# EAGLE schematic SPI_Test (EAGLE 9.6.2)
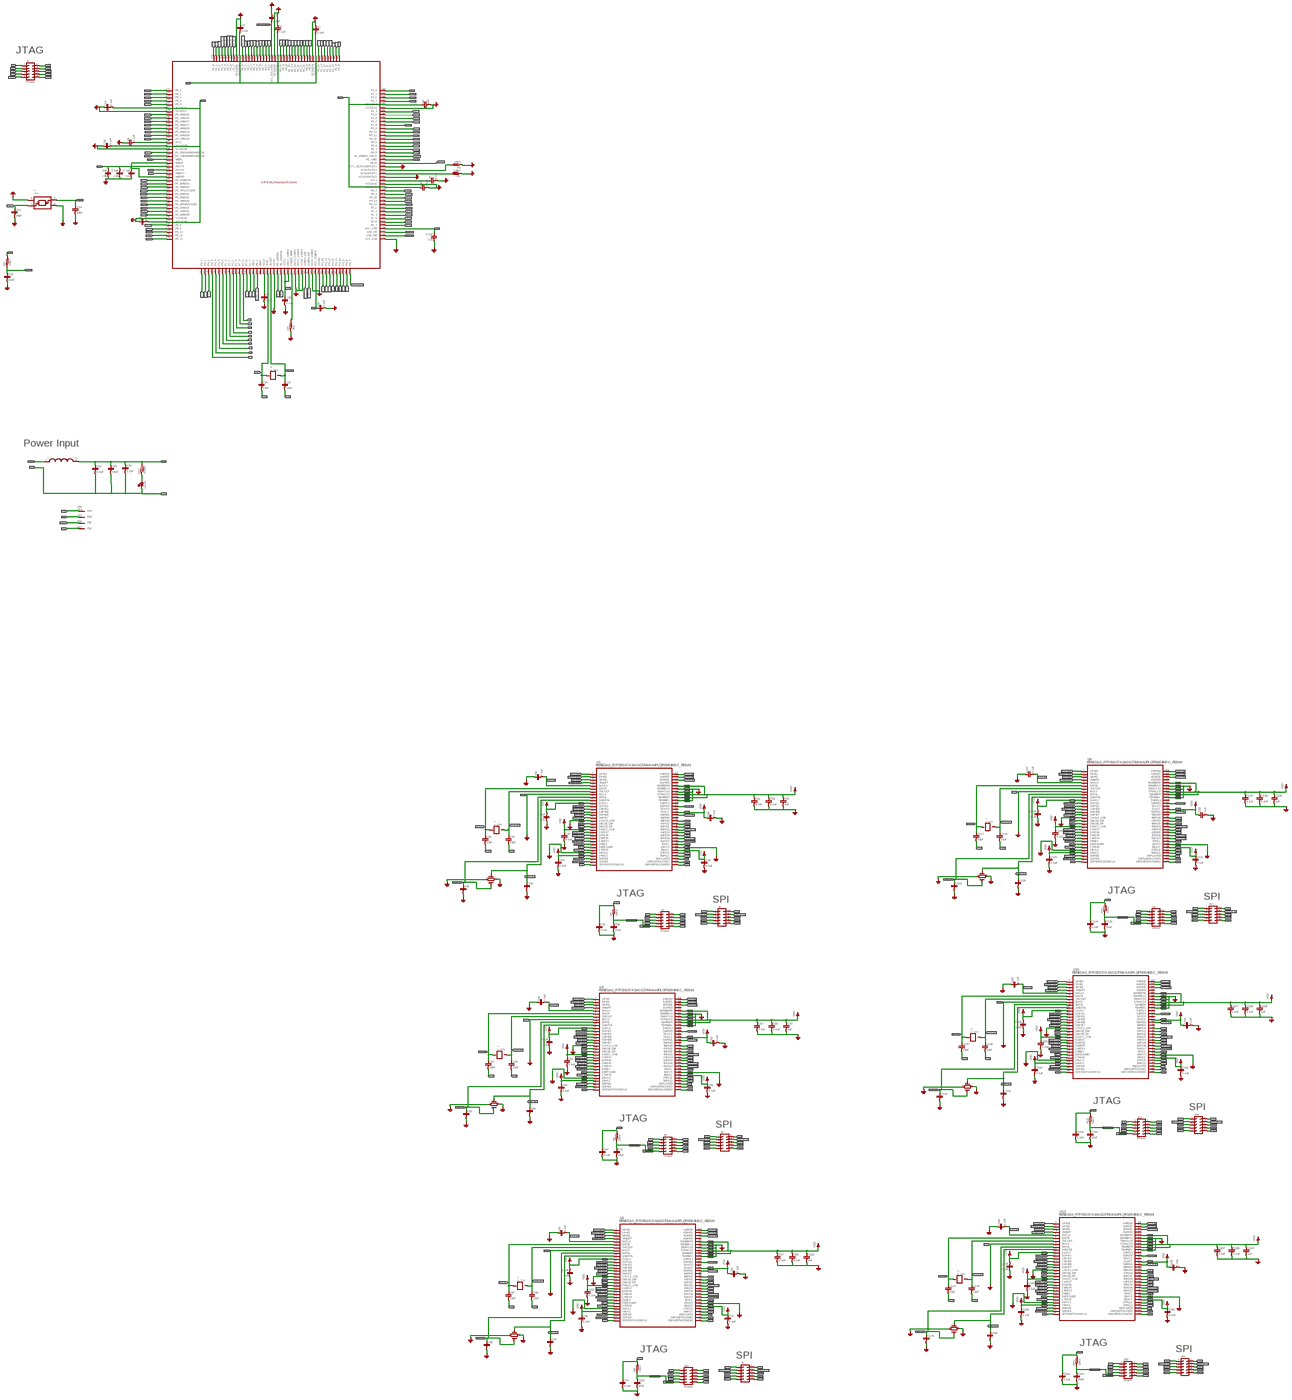
[diagram p0: schematic, sheet 1, overview]
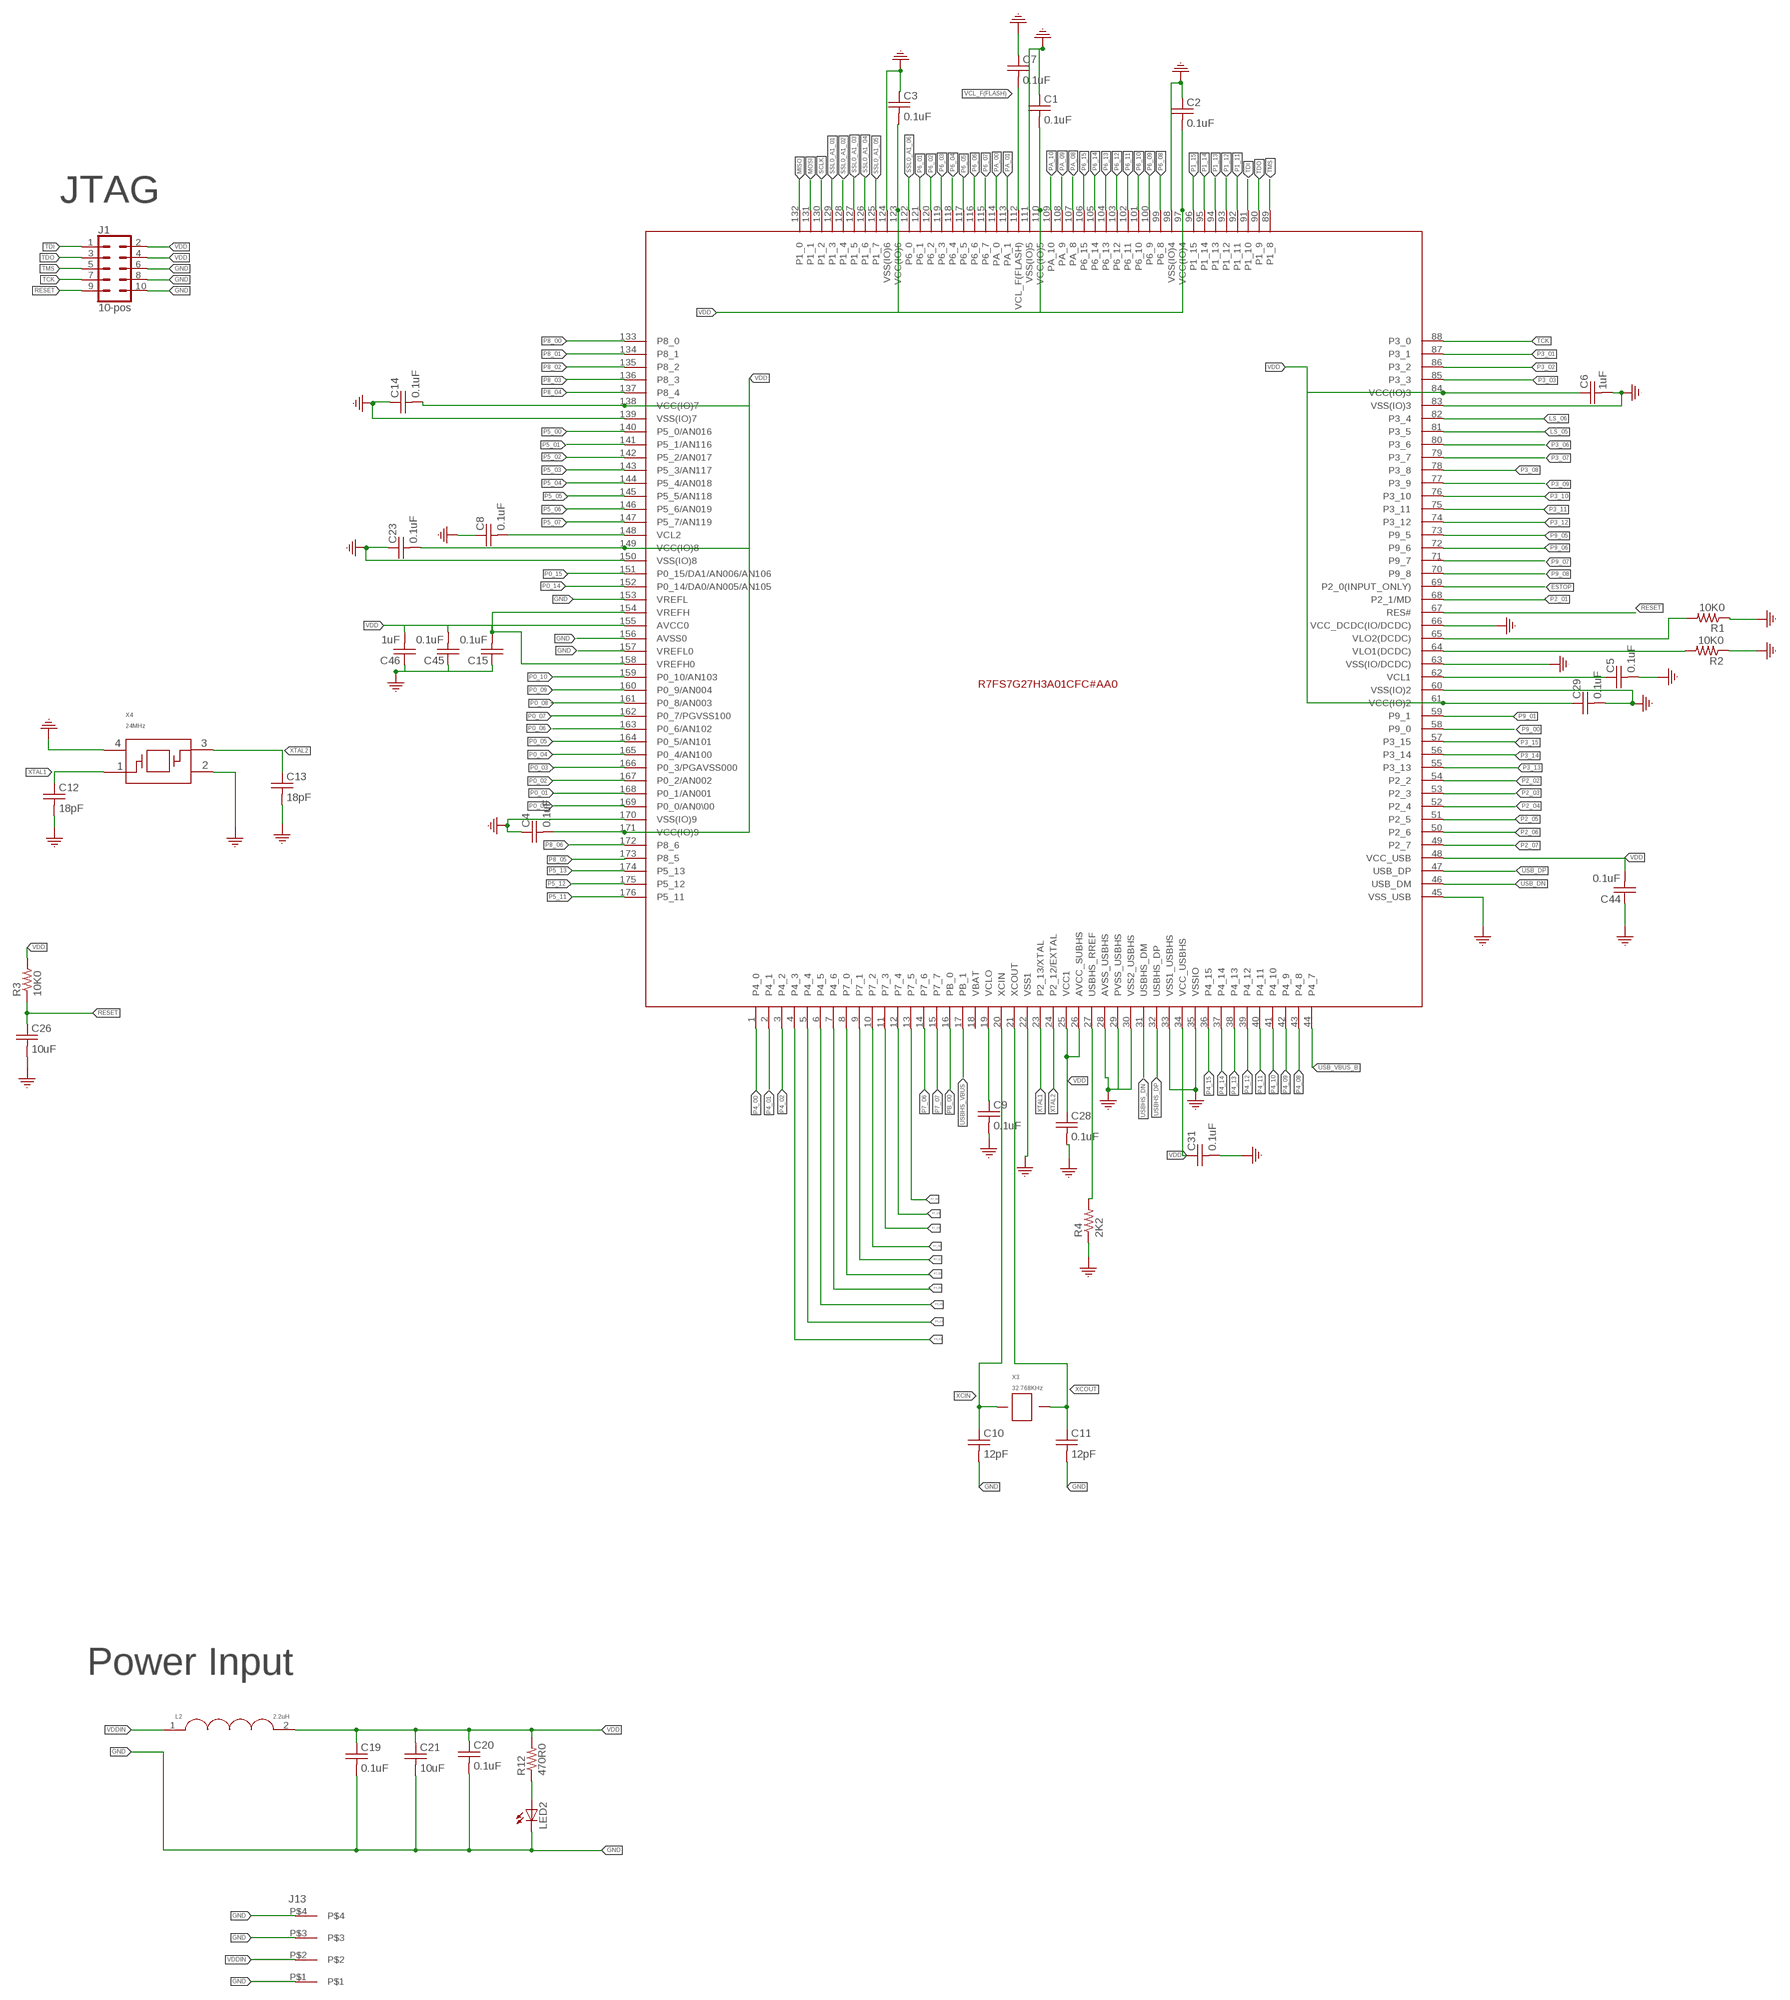
[diagram p1: schematic, sheet 1, part 1 of 5]
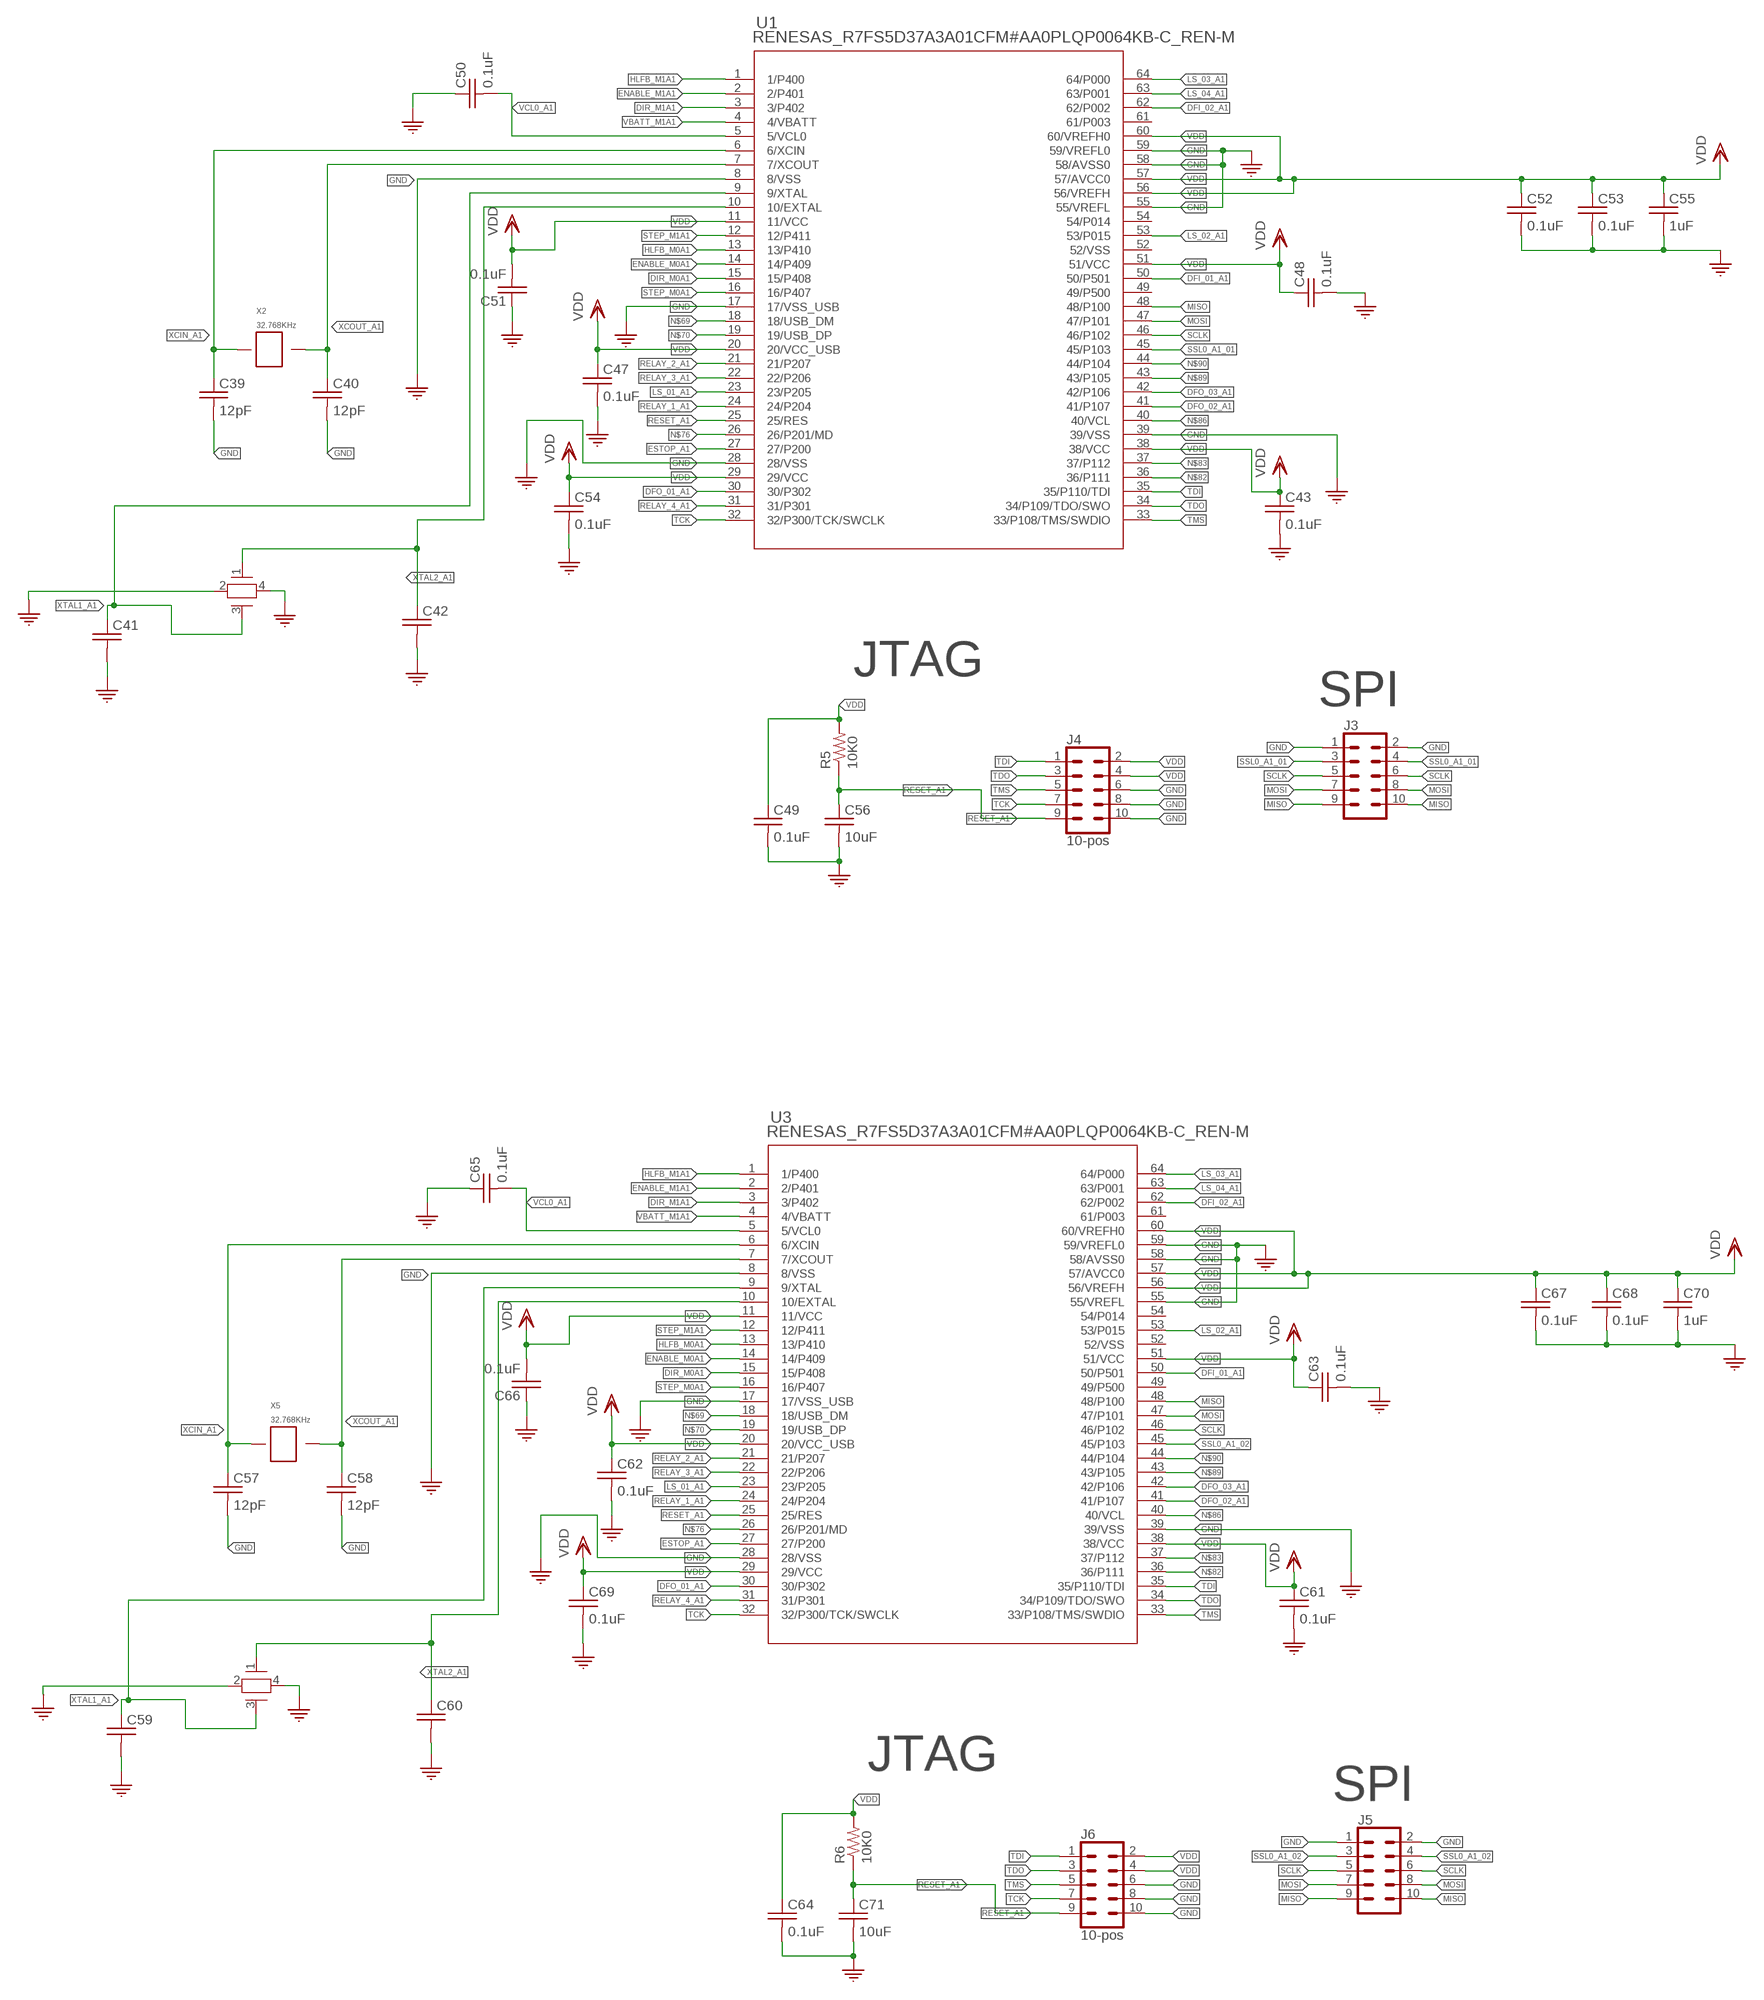
[diagram p2: schematic, sheet 1, part 2 of 5]
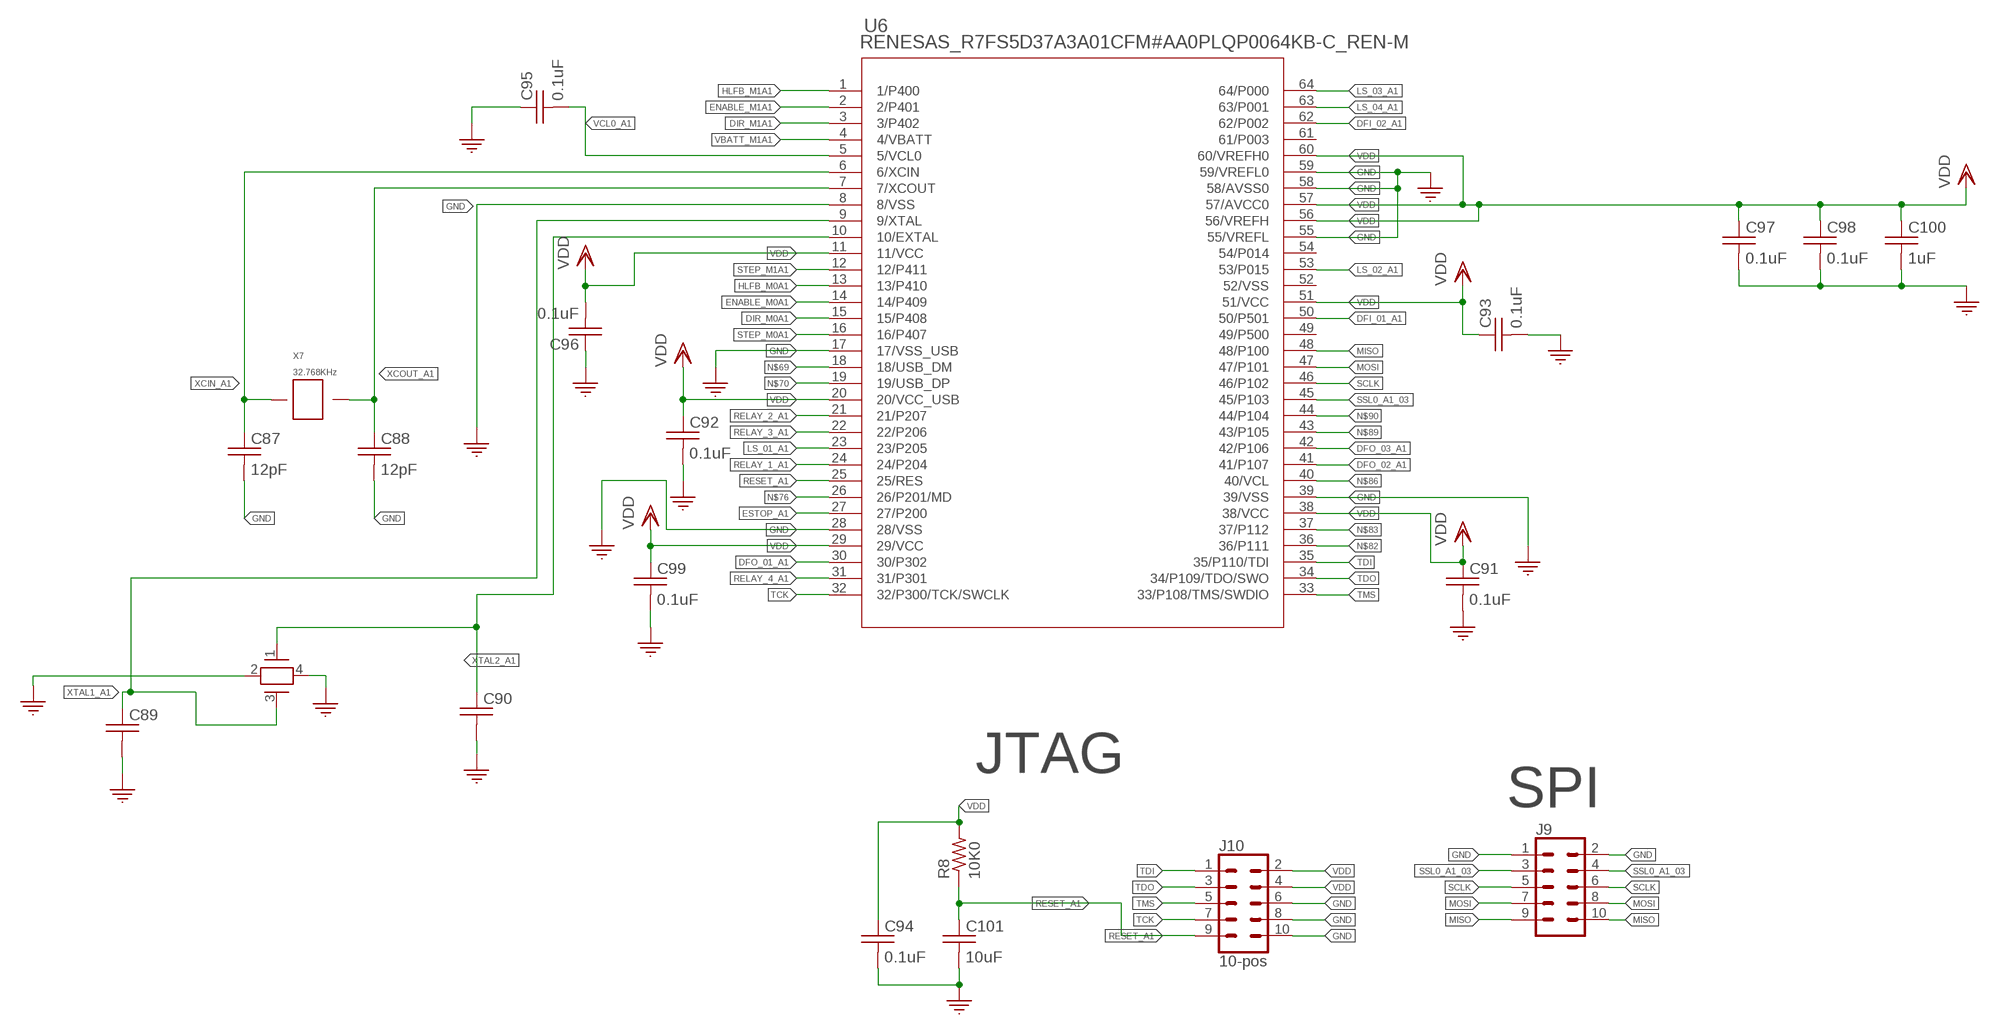
[diagram p3: schematic, sheet 1, part 3 of 5]
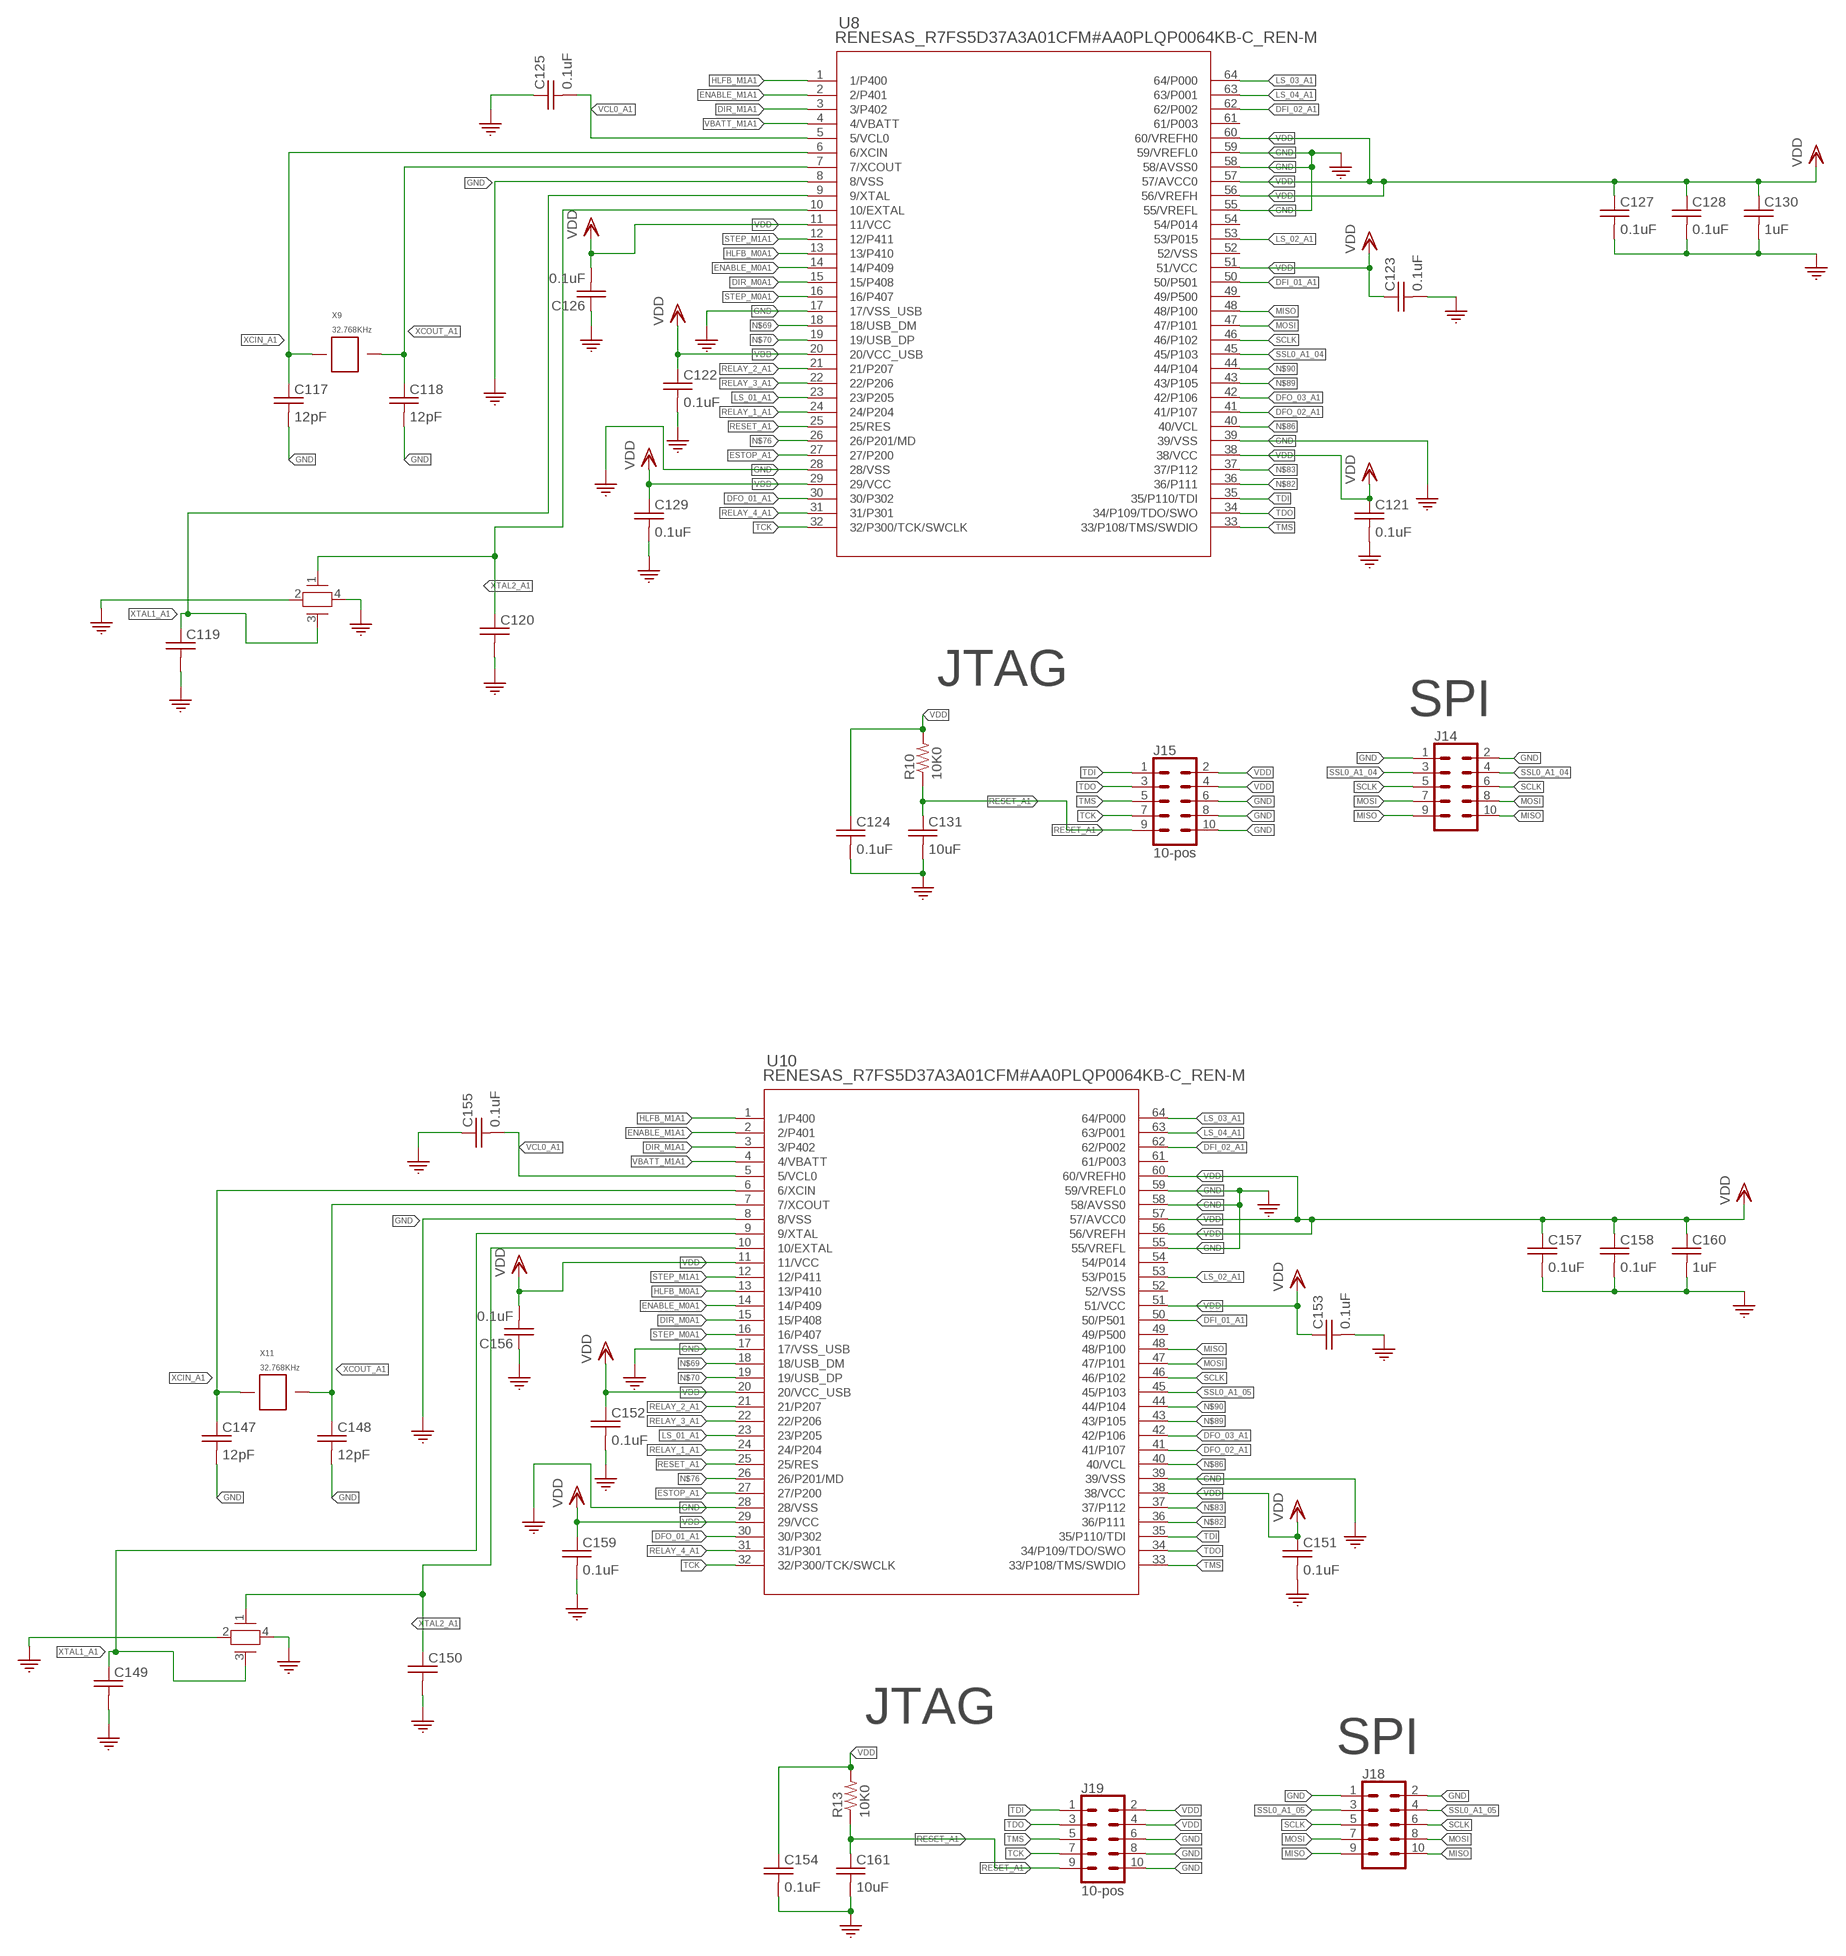
[diagram p4: schematic, sheet 1, part 4 of 5]
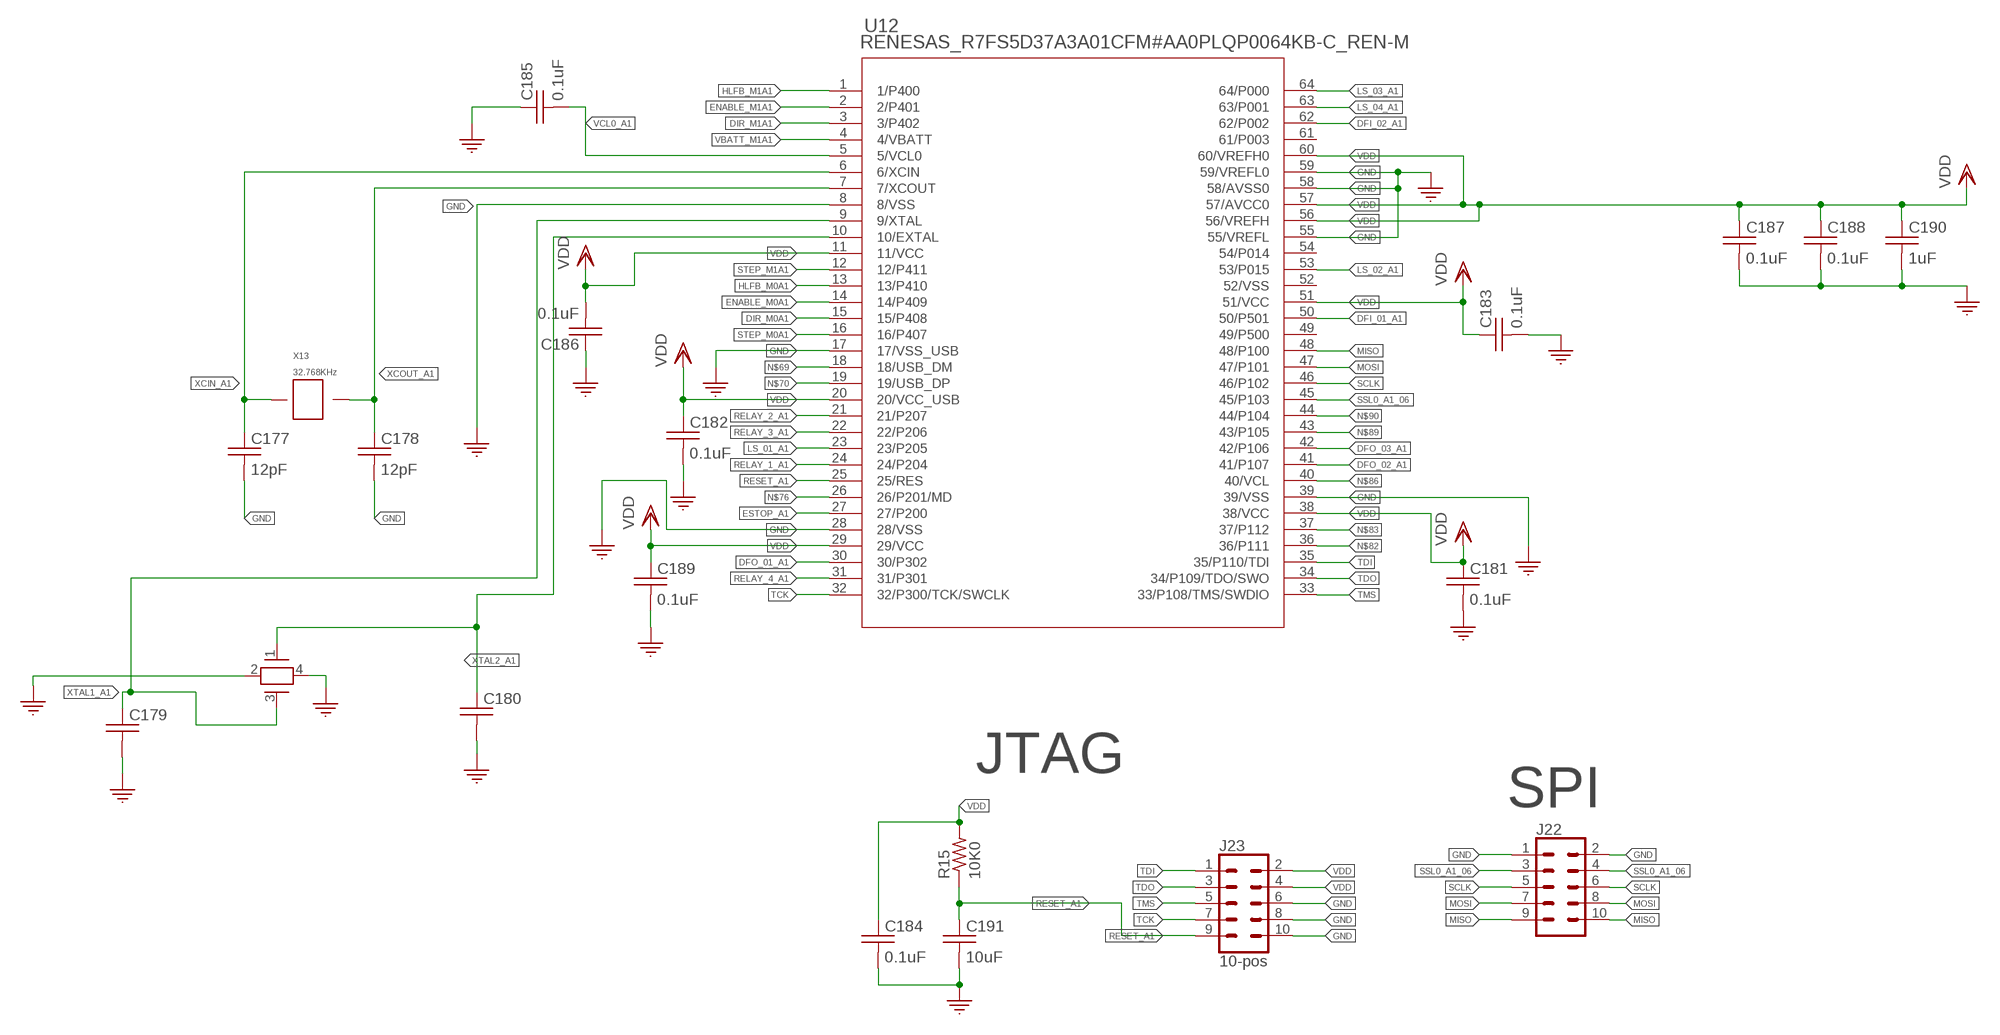
[diagram p5: schematic, sheet 1, part 5 of 5]

## Parts
C1  0.1uF  C_0402_0.1UF  [0402]
C2  0.1uF  C_0402_0.1UF  [0402]
C3  0.1uF  C_0402_0.1UF  [0402]
C4  0.1uF  C_0402_0.1UF  [0402]
C5  0.1uF  C_0402_0.1UF  [0402]
C6  1uF  C_0402_1UF  [0402]
C7  0.1uF  C_0402_0.1UF  [0402]
C8  0.1uF  C_0402_0.1UF  [0402]
C9  0.1uF  C_0402_0.1UF  [0402]
C10  12pF  C_0402_12PF  [0402]
C11  12pF  C_0402_12PF  [0402]
C12  18pF  C_0402_18PF  [0402]
C13  18pF  C_0402_18PF  [0402]
C14  0.1uF  C_0402_0.1UF  [0402]
C15  0.1uF  C_0402_0.1UF  [0402]
C19  0.1uF  C_0402_0.1UF  [0402]
C20  0.1uF  C_0402_0.1UF  [0402]
C21  10uF  C_0402_10UF  [0402]
C23  0.1uF  C_0402_0.1UF  [0402]
C26  10uF  C_0402_10UF  [0402]
C28  0.1uF  C_0402_0.1UF  [0402]
C29  0.1uF  C_0402_0.1UF  [0402]
C31  0.1uF  C_0402_0.1UF  [0402]
C39  12pF  C_0402_12PF  [0402]
C40  12pF  C_0402_12PF  [0402]
C41  10pF  C_0402_10PF  [0402]
C42  10pF  C_0402_10PF  [0402]
C43  0.1uF  C_0402_0.1UF  [0402]
C44  0.1uF  C_0402_0.1UF  [0402]
C45  0.1uF  C_0402_0.1UF  [0402]
C46  1uF  C_0402_1UF  [0402]
C47  0.1uF  C_0402_0.1UF  [0402]
C48  0.1uF  C_0402_0.1UF  [0402]
C49  0.1uF  C_0402_0.1UF  [0402]
C50  0.1uF  C_0402_0.1UF  [0402]
C51  0.1uF  C_0402_0.1UF  [0402]
C52  0.1uF  C_0402_0.1UF  [0402]
C53  0.1uF  C_0402_0.1UF  [0402]
C54  0.1uF  C_0402_0.1UF  [0402]
C55  1uF  C_0402_1UF  [0402]
C56  10uF  C_0402_10UF  [0402]
C57  12pF  C_0402_12PF  [0402]
C58  12pF  C_0402_12PF  [0402]
C59  10pF  C_0402_10PF  [0402]
C60  10pF  C_0402_10PF  [0402]
C61  0.1uF  C_0402_0.1UF  [0402]
C62  0.1uF  C_0402_0.1UF  [0402]
C63  0.1uF  C_0402_0.1UF  [0402]
C64  0.1uF  C_0402_0.1UF  [0402]
C65  0.1uF  C_0402_0.1UF  [0402]
C66  0.1uF  C_0402_0.1UF  [0402]
C67  0.1uF  C_0402_0.1UF  [0402]
C68  0.1uF  C_0402_0.1UF  [0402]
C69  0.1uF  C_0402_0.1UF  [0402]
C70  1uF  C_0402_1UF  [0402]
C71  10uF  C_0402_10UF  [0402]
C87  12pF  C_0402_12PF  [0402]
C88  12pF  C_0402_12PF  [0402]
C89  10pF  C_0402_10PF  [0402]
C90  10pF  C_0402_10PF  [0402]
C91  0.1uF  C_0402_0.1UF  [0402]
C92  0.1uF  C_0402_0.1UF  [0402]
C93  0.1uF  C_0402_0.1UF  [0402]
C94  0.1uF  C_0402_0.1UF  [0402]
C95  0.1uF  C_0402_0.1UF  [0402]
C96  0.1uF  C_0402_0.1UF  [0402]
C97  0.1uF  C_0402_0.1UF  [0402]
C98  0.1uF  C_0402_0.1UF  [0402]
C99  0.1uF  C_0402_0.1UF  [0402]
C100  1uF  C_0402_1UF  [0402]
C101  10uF  C_0402_10UF  [0402]
C117  12pF  C_0402_12PF  [0402]
C118  12pF  C_0402_12PF  [0402]
C119  10pF  C_0402_10PF  [0402]
C120  10pF  C_0402_10PF  [0402]
C121  0.1uF  C_0402_0.1UF  [0402]
C122  0.1uF  C_0402_0.1UF  [0402]
C123  0.1uF  C_0402_0.1UF  [0402]
C124  0.1uF  C_0402_0.1UF  [0402]
C125  0.1uF  C_0402_0.1UF  [0402]
C126  0.1uF  C_0402_0.1UF  [0402]
C127  0.1uF  C_0402_0.1UF  [0402]
C128  0.1uF  C_0402_0.1UF  [0402]
C129  0.1uF  C_0402_0.1UF  [0402]
C130  1uF  C_0402_1UF  [0402]
C131  10uF  C_0402_10UF  [0402]
C147  12pF  C_0402_12PF  [0402]
C148  12pF  C_0402_12PF  [0402]
C149  10pF  C_0402_10PF  [0402]
C150  10pF  C_0402_10PF  [0402]
C151  0.1uF  C_0402_0.1UF  [0402]
C152  0.1uF  C_0402_0.1UF  [0402]
C153  0.1uF  C_0402_0.1UF  [0402]
C154  0.1uF  C_0402_0.1UF  [0402]
C155  0.1uF  C_0402_0.1UF  [0402]
C156  0.1uF  C_0402_0.1UF  [0402]
C157  0.1uF  C_0402_0.1UF  [0402]
C158  0.1uF  C_0402_0.1UF  [0402]
C159  0.1uF  C_0402_0.1UF  [0402]
C160  1uF  C_0402_1UF  [0402]
C161  10uF  C_0402_10UF  [0402]
C177  12pF  C_0402_12PF  [0402]
C178  12pF  C_0402_12PF  [0402]
C179  10pF  C_0402_10PF  [0402]
C180  10pF  C_0402_10PF  [0402]
C181  0.1uF  C_0402_0.1UF  [0402]
C182  0.1uF  C_0402_0.1UF  [0402]
C183  0.1uF  C_0402_0.1UF  [0402]
C184  0.1uF  C_0402_0.1UF  [0402]
C185  0.1uF  C_0402_0.1UF  [0402]
C186  0.1uF  C_0402_0.1UF  [0402]
C187  0.1uF  C_0402_0.1UF  [0402]
C188  0.1uF  C_0402_0.1UF  [0402]
C189  0.1uF  C_0402_0.1UF  [0402]
C190  1uF  C_0402_1UF  [0402]
C191  10uF  C_0402_10UF  [0402]
J1  10-pos  CONN_05X2_RAPTH  [2X5]
J3  CONN_05X2PTH  [2X5]
J4  10-pos  CONN_05X2_RAPTH  [2X5]
J5  CONN_05X2PTH  [2X5]
J6  10-pos  CONN_05X2_RAPTH  [2X5]
J9  CONN_05X2PTH  [2X5]
J10  10-pos  CONN_05X2_RAPTH  [2X5]
J13  4-pos  3.81MM_1_X_4_RT_ANGLE_PLUG_HEADER  [1X4_3.81MM_PITCH]
J14  CONN_05X2PTH  [2X5]
J15  10-pos  CONN_05X2_RAPTH  [2X5]
J18  CONN_05X2PTH  [2X5]
J19  10-pos  CONN_05X2_RAPTH  [2X5]
J22  CONN_05X2PTH  [2X5]
J23  10-pos  CONN_05X2_RAPTH  [2X5]
L2  2.2uH  INDUCTOR_1008_2.2_MH_1.3A  [1008]
LED2  Green  LED_0805_GREEN  [0805]
R1  10K0  R_0402_10K0  [0402]
R2  10K0  R_0402_10K0  [0402]
R3  10K0  R_0402_10K0  [0402]
R4  2K2  R_0402_2K2  [0402]
R5  10K0  R_0402_10K0  [0402]
R6  10K0  R_0402_10K0  [0402]
R8  10K0  R_0402_10K0  [0402]
R10  10K0  R_0402_10K0  [0402]
R12  470R0  R_0402_470R0  [0402]
R13  10K0  R_0402_10K0  [0402]
R15  10K0  R_0402_10K0  [0402]
U1  RENESAS_R7FS5D37A3A01CFM#AA0PLQP0064KB-C_REN-M  [PLQP0064KB-C_REN-M]
U2  S7G2LQFP176  RENESAS_S7G2_X_176  [LQFP176_24X24]
U3  RENESAS_R7FS5D37A3A01CFM#AA0PLQP0064KB-C_REN-M  [PLQP0064KB-C_REN-M]
U6  RENESAS_R7FS5D37A3A01CFM#AA0PLQP0064KB-C_REN-M  [PLQP0064KB-C_REN-M]
U8  RENESAS_R7FS5D37A3A01CFM#AA0PLQP0064KB-C_REN-M  [PLQP0064KB-C_REN-M]
U10  RENESAS_R7FS5D37A3A01CFM#AA0PLQP0064KB-C_REN-M  [PLQP0064KB-C_REN-M]
U12  RENESAS_R7FS5D37A3A01CFM#AA0PLQP0064KB-C_REN-M  [PLQP0064KB-C_REN-M]
X2  32.768KHz  XTAL_32.768KHZ  [SMD_X_2_PADS]
X3  32.768KHz  XTAL_32.768KHZ  [SMD_X_2_PADS]
X4  24MHz  XTAL_24_MHZ  [SMD_3225]
X5  32.768KHz  XTAL_32.768KHZ  [SMD_X_2_PADS]
X7  32.768KHz  XTAL_32.768KHZ  [SMD_X_2_PADS]
X9  32.768KHz  XTAL_32.768KHZ  [SMD_X_2_PADS]
X11  32.768KHz  XTAL_32.768KHZ  [SMD_X_2_PADS]
X13  32.768KHz  XTAL_32.768KHZ  [SMD_X_2_PADS]
Y1  XTAL_12MHZ_ABM8G-12.000MHZ-B4Y-T  [CRYSTAL_ABM8G_ABR]
Y3  XTAL_12MHZ_ABM8G-12.000MHZ-B4Y-T  [CRYSTAL_ABM8G_ABR]
Y5  XTAL_12MHZ_ABM8G-12.000MHZ-B4Y-T  [CRYSTAL_ABM8G_ABR]
Y7  XTAL_12MHZ_ABM8G-12.000MHZ-B4Y-T  [CRYSTAL_ABM8G_ABR]
Y9  XTAL_12MHZ_ABM8G-12.000MHZ-B4Y-T  [CRYSTAL_ABM8G_ABR]
Y11  XTAL_12MHZ_ABM8G-12.000MHZ-B4Y-T  [CRYSTAL_ABM8G_ABR]

## Nets
DFI_01_A1: U1.50(50/P501) U3.50(50/P501) U6.50(50/P501) U8.50(50/P501) U10.50(50/P501) U12.50(50/P501)
DFI_02_A1: U1.62(62/P002) U3.62(62/P002) U6.62(62/P002) U8.62(62/P002) U10.62(62/P002) U12.62(62/P002)
DFO_01_A1: U1.30(30/P302) U3.30(30/P302) U6.30(30/P302) U8.30(30/P302) U10.30(30/P302) U12.30(30/P302)
DFO_02_A1: U1.41(41/P107) U3.41(41/P107) U6.41(41/P107) U8.41(41/P107) U10.41(41/P107) U12.41(41/P107)
DFO_03_A1: U1.42(42/P106) U3.42(42/P106) U6.42(42/P106) U8.42(42/P106) U10.42(42/P106) U12.42(42/P106)
DIR_M0A1: U1.15(15/P408) U3.15(15/P408) U6.15(15/P408) U8.15(15/P408) U10.15(15/P408) U12.15(15/P408)
DIR_M1A1: U1.3(3/P402) U3.3(3/P402) U6.3(3/P402) U8.3(3/P402) U10.3(3/P402) U12.3(3/P402)
ENABLE_M0A1: U1.14(14/P409) U3.14(14/P409) U6.14(14/P409) U8.14(14/P409) U10.14(14/P409) U12.14(14/P409)
ENABLE_M1A1: U1.2(2/P401) U3.2(2/P401) U6.2(2/P401) U8.2(2/P401) U10.2(2/P401) U12.2(2/P401)
ESTOP: U2.69(P2_0(INPUT_ONLY))
ESTOP_A1: U1.27(27/P200) U3.27(27/P200) U6.27(27/P200) U8.27(27/P200) U10.27(27/P200) U12.27(27/P200)
GND: C1.P$1 C2.P$1 C3.P$1 C4.P$1 C5.P$2 C6.P$2 C7.P$1 C8.P$1 C9.P$2 C10.P$2 C11.P$2 C12.P$2 C13.P$2 C14.P$1 C15.P$1 C19.P$2 C20.P$2 C21.P$2 C23.P$1 C26.P$2 C28.P$2 C29.P$2 C31.P$2 C39.P$2 C40.P$2 C41.P$2 C42.P$2 C43.P$2 C44.P$1 C45.P$1 C46.P$1 C47.P$2 C48.P$2 C49.P$2 C50.P$1 C51.P$1 C52.P$2 C53.P$2 C54.P$2 C55.P$2 C56.P$2 C57.P$2 C58.P$2 C59.P$2 C60.P$2 C61.P$2 C62.P$2 C63.P$2 C64.P$2 C65.P$1 C66.P$1 C67.P$2 C68.P$2 C69.P$2 C70.P$2 C71.P$2 C87.P$2 C88.P$2 C89.P$2 C90.P$2 C91.P$2 C92.P$2 C93.P$2 C94.P$2 C95.P$1 C96.P$1 C97.P$2 C98.P$2 C99.P$2 C100.P$2 C101.P$2 C117.P$2 C118.P$2 C119.P$2 C120.P$2 C121.P$2 C122.P$2 C123.P$2 C124.P$2 C125.P$1 C126.P$1 C127.P$2 C128.P$2 C129.P$2 C130.P$2 C131.P$2 C147.P$2 C148.P$2 C149.P$2 C150.P$2 C151.P$2 C152.P$2 C153.P$2 C154.P$2 C155.P$1 C156.P$1 C157.P$2 C158.P$2 C159.P$2 C160.P$2 C161.P$2 C177.P$2 C178.P$2 C179.P$2 C180.P$2 C181.P$2 C182.P$2 C183.P$2 C184.P$2 C185.P$1 C186.P$1 C187.P$2 C188.P$2 C189.P$2 C190.P$2 C191.P$2 J1.6 J1.8 J1.10 J3.1 J3.2 J4.6 J4.8 J4.10 J5.1 J5.2 J6.6 J6.8 J6.10 J9.1 J9.2 J10.6 J10.8 J10.10 J13.P$1 J13.P$3 J13.P$4 J14.1 J14.2 J15.6 J15.8 J15.10 J18.1 J18.2 J19.6 J19.8 J19.10 J22.1 J22.2 J23.6 J23.8 J23.10 LED2.2(C) R1.P$1 R2.P$1 R4.P$1 U1.8(8/VSS) U1.17(17/VSS_USB) U1.28(28/VSS) U1.39(39/VSS) U1.55(55/VREFL) U1.58(58/AVSS0) U1.59(59/VREFL0) U2.22(VSS1) U2.28(AVSS_USBHS) U2.29(PVSS_USBHS) U2.30(VSS2_USBHS) U2.33(VSS1_USBHS) U2.35(VSSIO) U2.45(VSS_USB) U2.60(VSS(IO)2) U2.63(VSS(IO/DCDC)) U2.66(VCC_DCDC(IO/DCDC)) U2.83(VSS(IO)3) U2.98(VSS(IO)4) U2.111(VSS(IO)5) U2.124(VSS(IO)6) U2.139(VSS(IO)7) U2.150(VSS(IO)8) U2.153(VREFL) U2.156(AVSS0) U2.157(VREFL0) U2.170(VSS(IO)9) U3.8(8/VSS) U3.17(17/VSS_USB) U3.28(28/VSS) U3.39(39/VSS) U3.55(55/VREFL) U3.58(58/AVSS0) U3.59(59/VREFL0) U6.8(8/VSS) U6.17(17/VSS_USB) U6.28(28/VSS) U6.39(39/VSS) U6.55(55/VREFL) U6.58(58/AVSS0) U6.59(59/VREFL0) U8.8(8/VSS) U8.17(17/VSS_USB) U8.28(28/VSS) U8.39(39/VSS) U8.55(55/VREFL) U8.58(58/AVSS0) U8.59(59/VREFL0) U10.8(8/VSS) U10.17(17/VSS_USB) U10.28(28/VSS) U10.39(39/VSS) U10.55(55/VREFL) U10.58(58/AVSS0) U10.59(59/VREFL0) U12.8(8/VSS) U12.17(17/VSS_USB) U12.28(28/VSS) U12.39(39/VSS) U12.55(55/VREFL) U12.58(58/AVSS0) U12.59(59/VREFL0) X4.2 X4.4 Y1.2 Y1.4 Y3.2 Y3.4 Y5.2 Y5.4 Y7.2 Y7.4 Y9.2 Y9.4 Y11.2 Y11.4
HLFB_M0A1: U1.13(13/P410) U3.13(13/P410) U6.13(13/P410) U8.13(13/P410) U10.13(13/P410) U12.13(13/P410)
HLFB_M1A1: U1.1(1/P400) U3.1(1/P400) U6.1(1/P400) U8.1(1/P400) U10.1(1/P400) U12.1(1/P400)
LS_01_A1: U1.23(23/P205) U3.23(23/P205) U6.23(23/P205) U8.23(23/P205) U10.23(23/P205) U12.23(23/P205)
LS_02_A1: U1.53(53/P015) U3.53(53/P015) U6.53(53/P015) U8.53(53/P015) U10.53(53/P015) U12.53(53/P015)
LS_03_A1: U1.64(64/P000) U3.64(64/P000) U6.64(64/P000) U8.64(64/P000) U10.64(64/P000) U12.64(64/P000)
LS_04_A1: U1.63(63/P001) U3.63(63/P001) U6.63(63/P001) U8.63(63/P001) U10.63(63/P001) U12.63(63/P001)
LS_05: U2.81(P3_5)
LS_06: U2.82(P3_4)
MISO: J3.9 J3.10 J5.9 J5.10 J9.9 J9.10 J14.9 J14.10 J18.9 J18.10 J22.9 J22.10 U1.48(48/P100) U2.132(P1_0) U3.48(48/P100) U6.48(48/P100) U8.48(48/P100) U10.48(48/P100) U12.48(48/P100)
MOSI: J3.7 J3.8 J5.7 J5.8 J9.7 J9.8 J14.7 J14.8 J18.7 J18.8 J22.7 J22.8 U1.47(47/P101) U2.131(P1_1) U3.47(47/P101) U6.47(47/P101) U8.47(47/P101) U10.47(47/P101) U12.47(47/P101)
N$2: C8.P$2 U2.148(VCL2)
N$3: C9.P$1 U2.19(VCLO)
N$4: LED2.1(A) R12.P$1
N$9: C5.P$1 U2.62(VCL1)
N$10: R2.P$2 U2.64(VLO1(DCDC))
N$11: R1.P$2 U2.65(VLO2(DCDC))
N$12: R4.P$2 U2.27(USBHS_RREF)
N$69: U1.18(18/USB_DM) U3.18(18/USB_DM) U6.18(18/USB_DM) U8.18(18/USB_DM) U10.18(18/USB_DM) U12.18(18/USB_DM)
N$70: U1.19(19/USB_DP) U3.19(19/USB_DP) U6.19(19/USB_DP) U8.19(19/USB_DP) U10.19(19/USB_DP) U12.19(19/USB_DP)
N$76: U1.26(26/P201/MD) U3.26(26/P201/MD) U6.26(26/P201/MD) U8.26(26/P201/MD) U10.26(26/P201/MD) U12.26(26/P201/MD)
N$82: U1.36(36/P111) U3.36(36/P111) U6.36(36/P111) U8.36(36/P111) U10.36(36/P111) U12.36(36/P111)
N$83: U1.37(37/P112) U3.37(37/P112) U6.37(37/P112) U8.37(37/P112) U10.37(37/P112) U12.37(37/P112)
N$86: U1.40(40/VCL) U3.40(40/VCL) U6.40(40/VCL) U8.40(40/VCL) U10.40(40/VCL) U12.40(40/VCL)
N$89: U1.43(43/P105) U3.43(43/P105) U6.43(43/P105) U8.43(43/P105) U10.43(43/P105) U12.43(43/P105)
N$90: U1.44(44/P104) U3.44(44/P104) U6.44(44/P104) U8.44(44/P104) U10.44(44/P104) U12.44(44/P104)
P0_00: U2.169(P0_0/AN0\00)
P0_01: U2.168(P0_1/AN001)
P0_02: U2.167(P0_2/AN002)
P0_03: U2.166(P0_3/PGAVSS000)
P0_04: U2.165(P0_4/AN100)
P0_05: U2.164(P0_5/AN101)
P0_06: U2.163(P0_6/AN102)
P0_07: U2.162(P0_7/PGVSS100)
P0_08: U2.161(P0_8/AN003)
P0_09: U2.160(P0_9/AN004)
P0_10: U2.159(P0_10/AN103)
P0_14: U2.152(P0_14/DA0/AN005/AN105)
P0_15: U2.151(P0_15/DA1/AN006/AN106)
P1_11: U2.92(P1_11)
P1_12: U2.93(P1_12)
P1_13: U2.94(P1_13)
P1_14: U2.95(P1_14)
P1_15: U2.96(P1_15)
P2_01: U2.68(P2_1/MD)
P2_02: U2.54(P2_2)
P2_03: U2.53(P2_3)
P2_04: U2.52(P2_4)
P2_05: U2.51(P2_5)
P2_06: U2.50(P2_6)
P2_07: U2.49(P2_7)
P3_01: U2.87(P3_1)
P3_02: U2.86(P3_2)
P3_03: U2.85(P3_3)
P3_06: U2.80(P3_6)
P3_07: U2.79(P3_7)
P3_08: U2.78(P3_8)
P3_09: U2.77(P3_9)
P3_10: U2.76(P3_10)
P3_11: U2.75(P3_11)
P3_12: U2.74(P3_12)
P3_13: U2.55(P3_13)
P3_14: U2.56(P3_14)
P3_15: U2.57(P3_15)
P4_00: U2.1(P4_0)
P4_01: U2.2(P4_1)
P4_02: U2.3(P4_2)
P4_03: U2.4(P4_3)
P4_04: U2.5(P4_4)
P4_05: U2.6(P4_5)
P4_06: U2.7(P4_6)
P4_08: U2.43(P4_8)
P4_09: U2.42(P4_9)
P4_10: U2.41(P4_10)
P4_11: U2.40(P4_11)
P4_12: U2.39(P4_12)
P4_13: U2.38(P4_13)
P4_14: U2.37(P4_14)
P4_15: U2.36(P4_15)
P5_00: U2.140(P5_0/AN016)
P5_01: U2.141(P5_1/AN116)
P5_02: U2.142(P5_2/AN017)
P5_03: U2.143(P5_3/AN117)
P5_04: U2.144(P5_4/AN018)
P5_05: U2.145(P5_5/AN118)
P5_06: U2.146(P5_6/AN019)
P5_07: U2.147(P5_7/AN119)
P5_11: U2.176(P5_11)
P5_12: U2.175(P5_12)
P5_13: U2.174(P5_13)
P6_01: U2.121(P6_1)
P6_02: U2.120(P6_2)
P6_03: U2.119(P6_3)
P6_04: U2.118(P6_4)
P6_05: U2.117(P6_5)
P6_06: U2.116(P6_6)
P6_07: U2.115(P6_7)
P6_08: U2.99(P6_8)
P6_09: U2.100(P6_9)
P6_10: U2.101(P6_10)
P6_11: U2.102(P6_11)
P6_12: U2.103(P6_12)
P6_13: U2.104(P6_13)
P6_14: U2.105(P6_14)
P6_15: U2.106(P6_15)
P7_00: U2.8(P7_0)
P7_01: U2.9(P7_1)
P7_02: U2.10(P7_2)
P7_03: U2.11(P7_3)
P7_04: U2.12(P7_4)
P7_05: U2.13(P7_5)
P7_06: U2.14(P7_6)
P7_07: U2.15(P7_7)
P8_00: U2.133(P8_0)
P8_01: U2.134(P8_1)
P8_02: U2.135(P8_2)
P8_03: U2.136(P8_3)
P8_04: U2.137(P8_4)
P8_05: U2.173(P8_5)
P8_06: U2.172(P8_6)
P9_00: U2.58(P9_0)
P9_01: U2.59(P9_1)
P9_05: U2.73(P9_5)
P9_06: U2.72(P9_6)
P9_07: U2.71(P9_7)
P9_08: U2.70(P9_8)
PA_00: U2.114(PA_0)
PA_01: U2.113(PA_1)
PA_08: U2.107(PA_8)
PA_09: U2.108(PA_9)
PA_10: U2.109(PA_10)
PB_00: U2.16(PB_0)
RELAY_1_A1: U1.24(24/P204) U3.24(24/P204) U6.24(24/P204) U8.24(24/P204) U10.24(24/P204) U12.24(24/P204)
RELAY_2_A1: U1.21(21/P207) U3.21(21/P207) U6.21(21/P207) U8.21(21/P207) U10.21(21/P207) U12.21(21/P207)
RELAY_3_A1: U1.22(22/P206) U3.22(22/P206) U6.22(22/P206) U8.22(22/P206) U10.22(22/P206) U12.22(22/P206)
RELAY_4_A1: U1.31(31/P301) U3.31(31/P301) U6.31(31/P301) U8.31(31/P301) U10.31(31/P301) U12.31(31/P301)
RESET: C26.P$1 J1.9 R3.P$1 U2.67(RES#)
RESET_A1: C56.P$1 C71.P$1 C101.P$1 C131.P$1 C161.P$1 C191.P$1 J4.9 J6.9 J10.9 J15.9 J19.9 J23.9 R5.P$1 R6.P$1 R8.P$1 R10.P$1 R13.P$1 R15.P$1 U1.25(25/RES) U3.25(25/RES) U6.25(25/RES) U8.25(25/RES) U10.25(25/RES) U12.25(25/RES)
SCLK: J3.5 J3.6 J5.5 J5.6 J9.5 J9.6 J14.5 J14.6 J18.5 J18.6 J22.5 J22.6 U1.46(46/P102) U2.130(P1_2) U3.46(46/P102) U6.46(46/P102) U8.46(46/P102) U10.46(46/P102) U12.46(46/P102)
SSL0_A1_01: J3.3 J3.4 U1.45(45/P103) U2.129(P1_3)
SSL0_A1_02: J5.3 J5.4 U2.128(P1_4) U3.45(45/P103)
SSL0_A1_03: J9.3 J9.4 U2.127(P1_5) U6.45(45/P103)
SSL0_A1_04: J14.3 J14.4 U2.126(P1_6) U8.45(45/P103)
SSL0_A1_05: J18.3 J18.4 U2.125(P1_7) U10.45(45/P103)
SSL0_A1_06: J22.3 J22.4 U2.122(P6_0) U12.45(45/P103)
STEP_M0A1: U1.16(16/P407) U3.16(16/P407) U6.16(16/P407) U8.16(16/P407) U10.16(16/P407) U12.16(16/P407)
STEP_M1A1: U1.12(12/P411) U3.12(12/P411) U6.12(12/P411) U8.12(12/P411) U10.12(12/P411) U12.12(12/P411)
TCK: J1.7 J4.7 J6.7 J10.7 J15.7 J19.7 J23.7 U1.32(32/P300/TCK/SWCLK) U2.88(P3_0) U3.32(32/P300/TCK/SWCLK) U6.32(32/P300/TCK/SWCLK) U8.32(32/P300/TCK/SWCLK) U10.32(32/P300/TCK/SWCLK) U12.32(32/P300/TCK/SWCLK)
TDI: J1.1 J4.1 J6.1 J10.1 J15.1 J19.1 J23.1 U1.35(35/P110/TDI) U2.91(P1_10) U3.35(35/P110/TDI) U6.35(35/P110/TDI) U8.35(35/P110/TDI) U10.35(35/P110/TDI) U12.35(35/P110/TDI)
TDO: J1.3 J4.3 J6.3 J10.3 J15.3 J19.3 J23.3 U1.34(34/P109/TDO/SWO) U2.90(P1_9) U3.34(34/P109/TDO/SWO) U6.34(34/P109/TDO/SWO) U8.34(34/P109/TDO/SWO) U10.34(34/P109/TDO/SWO) U12.34(34/P109/TDO/SWO)
TMS: J1.5 J4.5 J6.5 J10.5 J15.5 J19.5 J23.5 U1.33(33/P108/TMS/SWDIO) U2.89(P1_8) U3.33(33/P108/TMS/SWDIO) U6.33(33/P108/TMS/SWDIO) U8.33(33/P108/TMS/SWDIO) U10.33(33/P108/TMS/SWDIO) U12.33(33/P108/TMS/SWDIO)
USB_DN [USB_DIFF_PAIR]: U2.46(USB_DM)
USB_DP [USB_DIFF_PAIR]: U2.47(USB_DP)
USB_VBUS_B: U2.44(P4_7)
USBHS_DN: U2.31(USBHS_DM)
USBHS_DP: U2.32(USBHS_DP)
USBHS_VBUS: U2.17(PB_1)
VBATT_M1A1: U1.4(4/VBATT) U3.4(4/VBATT) U6.4(4/VBATT) U8.4(4/VBATT) U10.4(4/VBATT) U12.4(4/VBATT)
VCL0_A1: C50.P$2 C65.P$2 C95.P$2 C125.P$2 C155.P$2 C185.P$2 U1.5(5/VCL0) U3.5(5/VCL0) U6.5(5/VCL0) U8.5(5/VCL0) U10.5(5/VCL0) U12.5(5/VCL0)
VCL_F(FLASH): C7.P$2 U2.112(VCL_F(FLASH))
VDD: C1.P$2 C2.P$2 C3.P$2 C4.P$2 C6.P$1 C14.P$2 C15.P$2 C19.P$1 C20.P$1 C21.P$1 C23.P$2 C28.P$1 C29.P$1 C31.P$1 C43.P$1 C44.P$2 C45.P$2 C46.P$2 C47.P$1 C48.P$1 C49.P$1 C51.P$2 C52.P$1 C53.P$1 C54.P$1 C55.P$1 C61.P$1 C62.P$1 C63.P$1 C64.P$1 C66.P$2 C67.P$1 C68.P$1 C69.P$1 C70.P$1 C91.P$1 C92.P$1 C93.P$1 C94.P$1 C96.P$2 C97.P$1 C98.P$1 C99.P$1 C100.P$1 C121.P$1 C122.P$1 C123.P$1 C124.P$1 C126.P$2 C127.P$1 C128.P$1 C129.P$1 C130.P$1 C151.P$1 C152.P$1 C153.P$1 C154.P$1 C156.P$2 C157.P$1 C158.P$1 C159.P$1 C160.P$1 C181.P$1 C182.P$1 C183.P$1 C184.P$1 C186.P$2 C187.P$1 C188.P$1 C189.P$1 C190.P$1 J1.2 J1.4 J4.2 J4.4 J6.2 J6.4 J10.2 J10.4 J15.2 J15.4 J19.2 J19.4 J23.2 J23.4 L2.2 R3.P$2 R5.P$2 R6.P$2 R8.P$2 R10.P$2 R12.P$2 R13.P$2 R15.P$2 U1.11(11/VCC) U1.20(20/VCC_USB) U1.29(29/VCC) U1.38(38/VCC) U1.51(51/VCC) U1.56(56/VREFH) U1.57(57/AVCC0) U1.60(60/VREFH0) U2.25(VCC1) U2.26(AVCC_SUBHS) U2.34(VCC_USBHS) U2.48(VCC_USB) U2.61(VCC(IO)2) U2.84(VCC(IO)3) U2.97(VCC(IO)4) U2.110(VCC(IO)5) U2.123(VCC(IO)6) U2.138(VCC(IO)7) U2.149(VCC(IO)8) U2.154(VREFH) U2.155(AVCC0) U2.158(VREFH0) U2.171(VCC(IO)9) U3.11(11/VCC) U3.20(20/VCC_USB) U3.29(29/VCC) U3.38(38/VCC) U3.51(51/VCC) U3.56(56/VREFH) U3.57(57/AVCC0) U3.60(60/VREFH0) U6.11(11/VCC) U6.20(20/VCC_USB) U6.29(29/VCC) U6.38(38/VCC) U6.51(51/VCC) U6.56(56/VREFH) U6.57(57/AVCC0) U6.60(60/VREFH0) U8.11(11/VCC) U8.20(20/VCC_USB) U8.29(29/VCC) U8.38(38/VCC) U8.51(51/VCC) U8.56(56/VREFH) U8.57(57/AVCC0) U8.60(60/VREFH0) U10.11(11/VCC) U10.20(20/VCC_USB) U10.29(29/VCC) U10.38(38/VCC) U10.51(51/VCC) U10.56(56/VREFH) U10.57(57/AVCC0) U10.60(60/VREFH0) U12.11(11/VCC) U12.20(20/VCC_USB) U12.29(29/VCC) U12.38(38/VCC) U12.51(51/VCC) U12.56(56/VREFH) U12.57(57/AVCC0) U12.60(60/VREFH0)
VDDIN: J13.P$2 L2.1
XCIN: C10.P$1 U2.20(XCIN) X3.P$1
XCIN_A1: C39.P$1 C57.P$1 C87.P$1 C117.P$1 C147.P$1 C177.P$1 U1.6(6/XCIN) U3.6(6/XCIN) U6.6(6/XCIN) U8.6(6/XCIN) U10.6(6/XCIN) U12.6(6/XCIN) X2.P$1 X5.P$1 X7.P$1 X9.P$1 X11.P$1 X13.P$1
XCOUT: C11.P$1 U2.21(XCOUT) X3.P$2
XCOUT_A1: C40.P$1 C58.P$1 C88.P$1 C118.P$1 C148.P$1 C178.P$1 U1.7(7/XCOUT) U3.7(7/XCOUT) U6.7(7/XCOUT) U8.7(7/XCOUT) U10.7(7/XCOUT) U12.7(7/XCOUT) X2.P$2 X5.P$2 X7.P$2 X9.P$2 X11.P$2 X13.P$2
XTAL1: C12.P$1 U2.23(P2_13/XTAL) X4.1
XTAL1_A1: C41.P$1 C59.P$1 C89.P$1 C119.P$1 C149.P$1 C179.P$1 U1.9(9/XTAL) U3.9(9/XTAL) U6.9(9/XTAL) U8.9(9/XTAL) U10.9(9/XTAL) U12.9(9/XTAL) Y1.3 Y3.3 Y5.3 Y7.3 Y9.3 Y11.3
XTAL2: C13.P$1 U2.24(P2_12/EXTAL) X4.3
XTAL2_A1: C42.P$1 C60.P$1 C90.P$1 C120.P$1 C150.P$1 C180.P$1 U1.10(10/EXTAL) U3.10(10/EXTAL) U6.10(10/EXTAL) U8.10(10/EXTAL) U10.10(10/EXTAL) U12.10(10/EXTAL) Y1.1 Y3.1 Y5.1 Y7.1 Y9.1 Y11.1
Unconnected: U1.49(49/P500) U1.52(52/VSS) U1.54(54/P014) U1.61(61/P003) U2.18(VBAT) U3.49(49/P500) U3.52(52/VSS) U3.54(54/P014) U3.61(61/P003) U6.49(49/P500) U6.52(52/VSS) U6.54(54/P014) U6.61(61/P003) U8.49(49/P500) U8.52(52/VSS) U8.54(54/P014) U8.61(61/P003) U10.49(49/P500) U10.52(52/VSS) U10.54(54/P014) U10.61(61/P003) U12.49(49/P500) U12.52(52/VSS) U12.54(54/P014) U12.61(61/P003)

## Notes on the sheet
- JTAG
- Power Input
- JTAG | JTAG
- SPI | SPI
- JTAG
- SPI
- JTAG
- SPI
- JTAG
- JTAG | SPI
- SPI

## Library data of the parts
C1-C5 C7-C9 C14 C15 C19 C20 C23 C28 C29 C31 C43-C45 C47-C54 C61-C69 C91-C99 C121-C129 C151-C159 C181-C189 = 3D_MIG_Controller:C_0402_0.1UF; PARTNO: CL05F104ZO5NNNC
C6 C46 C55 C70 C100 C130 C160 C190 = 3D_MIG_Controller:C_0402_1UF; PARTNO: CL05A105KO5NNNC
C10 C11 C39 C40 C57 C58 C87 C88 C117 C118 C147 C148 C177 C178 = 3D_MIG_Controller:C_0402_12PF; PARTNO: CL05C120JB5NNNC
C12 C13 = 3D_MIG_Controller:C_0402_18PF; PARTNO: UMK105CG180JV-F
C21 C26 C56 C71 C101 C131 C161 C191 = 3D_MIG_Controller:C_0402_10UF; PARTNO: CL05A106MP8NUB8
C41 C42 C59 C60 C89 C90 C119 C120 C149 C150 C179 C180 = 3D_MIG_Controller:C_0402_10PF; PARTNO: CC0402JRNPO9BN100
J1 J4 J6 J10 J15 J19 J23 = 3D_MIG_Controller:CONN_05X2_RA: Connector Header Through Hole, Right Angle 10 position 0.100" (2.54mm); PARTNO: PH2RA-10-UA
J3 J5 J9 J14 J18 J22 = 3D_MIG_Controller:CONN_05X2: Multi connection point. Often used as Generic Header-pin footprint for 0.1 inch spaced/style header connections For AVR SPI programming port, see special device with nice symbol: "AVR_SPI_PROG_5x2.dev" You can populate with any combo of single row headers, but if you'd like an exact match, check these: 2x5 AVR ICSP Male Header <https://www.sparkfun.com/products/778> (PRT-00778) 2x5 Pin Shrouded Header <https://www.sparkfun.com/products/8506> (PRT-08506) On any of the 0.1 inch spaced packages, you can populate with these: Break Away Headers - Straight <https://www.sparkfun.com/products/116> (PRT-00116) Break Away Male Headers - Right Angle <https://www.sparkfun.com/products/553> (PRT-00553) Female Headers <https://www.sparkfun.com/products/115> (PRT-00115) Break Away Headers - Machine Pin <https://www.sparkfun.com/products/117> (PRT-00117) Break Away Female Headers - Swiss Machine Pin <https://www.sparkfun.com/products/743> (PRT-00743) Special note: the shrouded connector mates well with our 5x2 ribbon cables: 2x5 Pin IDC Ribbon Cable <https://www.sparkfun.com/products/8535> (PRT-08535); PROD_ID: CONN-08499; SF_ID: PRT-0778
J13 = 3D_MIG_Controller:3.81MM_1_X_4_RT_ANGLE_PLUG_HEADER: 4 Position Terminal Block Header, Male Pins, Shrouded (4 Side) 0.150" (3.81mm) 90°, Right Angle - Through Hole; PARTNO: 691322310004
L2 = 3D_MIG_Controller:INDUCTOR_1008_2.2_MH_1.3A; PARTNO: LQM2HPN2R2MG0L
LED2 = 3D_MIG_Controller:LED_0805_GREEN: Green 570nm LED Indication - Discrete 2.2V 0805 (2012 Metric); PARTNO: LG R971-KN-1
R1-R3 R5 R6 R8 R10 R13 R15 = 3D_MIG_Controller:R_0402_10K0; PARTNO: RMCF0402JT10K0
R4 = 3D_MIG_Controller:R_0402_2K2; PARTNO: RMCF0402JT2K20
R12 = 3D_MIG_Controller:R_0402_470R0; PARTNO: RMCF0402JT470R
U1 U3 U6 U8 U10 U12 = 3D_MIG_Controller:RENESAS_R7FS5D37A3A01CFM#AA0; COPYRIGHT: Copyright (C) 2023 Ultra Librarian. All rights reserved.; MFR_NAME: Renesas Electronics; PARTNO: R7FS3A37A3A01CFM#AA0
U2 = 3D_MIG_Controller:RENESAS_S7G2_X_176; PARTNO: R7FS7G27H3A01CFC#AA0
X2 X3 X5 X7 X9 X11 X13 = 3D_MIG_Controller:XTAL_32.768KHZ; PARTNO: ABS07-32.768KHZ-T
X4 = 3D_MIG_Controller:XTAL_24_MHZ; PARTNO: FA-238 24.0000MB-C3
Y1 Y3 Y5 Y7 Y9 Y11 = 3D_MIG_Controller:XTAL_12MHZ_ABM8G-12.000MHZ-B4Y-T; COPYRIGHT: Copyright (C) 2023 Ultra Librarian. All rights reserved.; MFR_NAME: Abracon; PARTNO: ABM8G-12.000MHZ-B4Y-T